# Altium schematic sheet CPU.SchDoc
size 420 x 297 mm
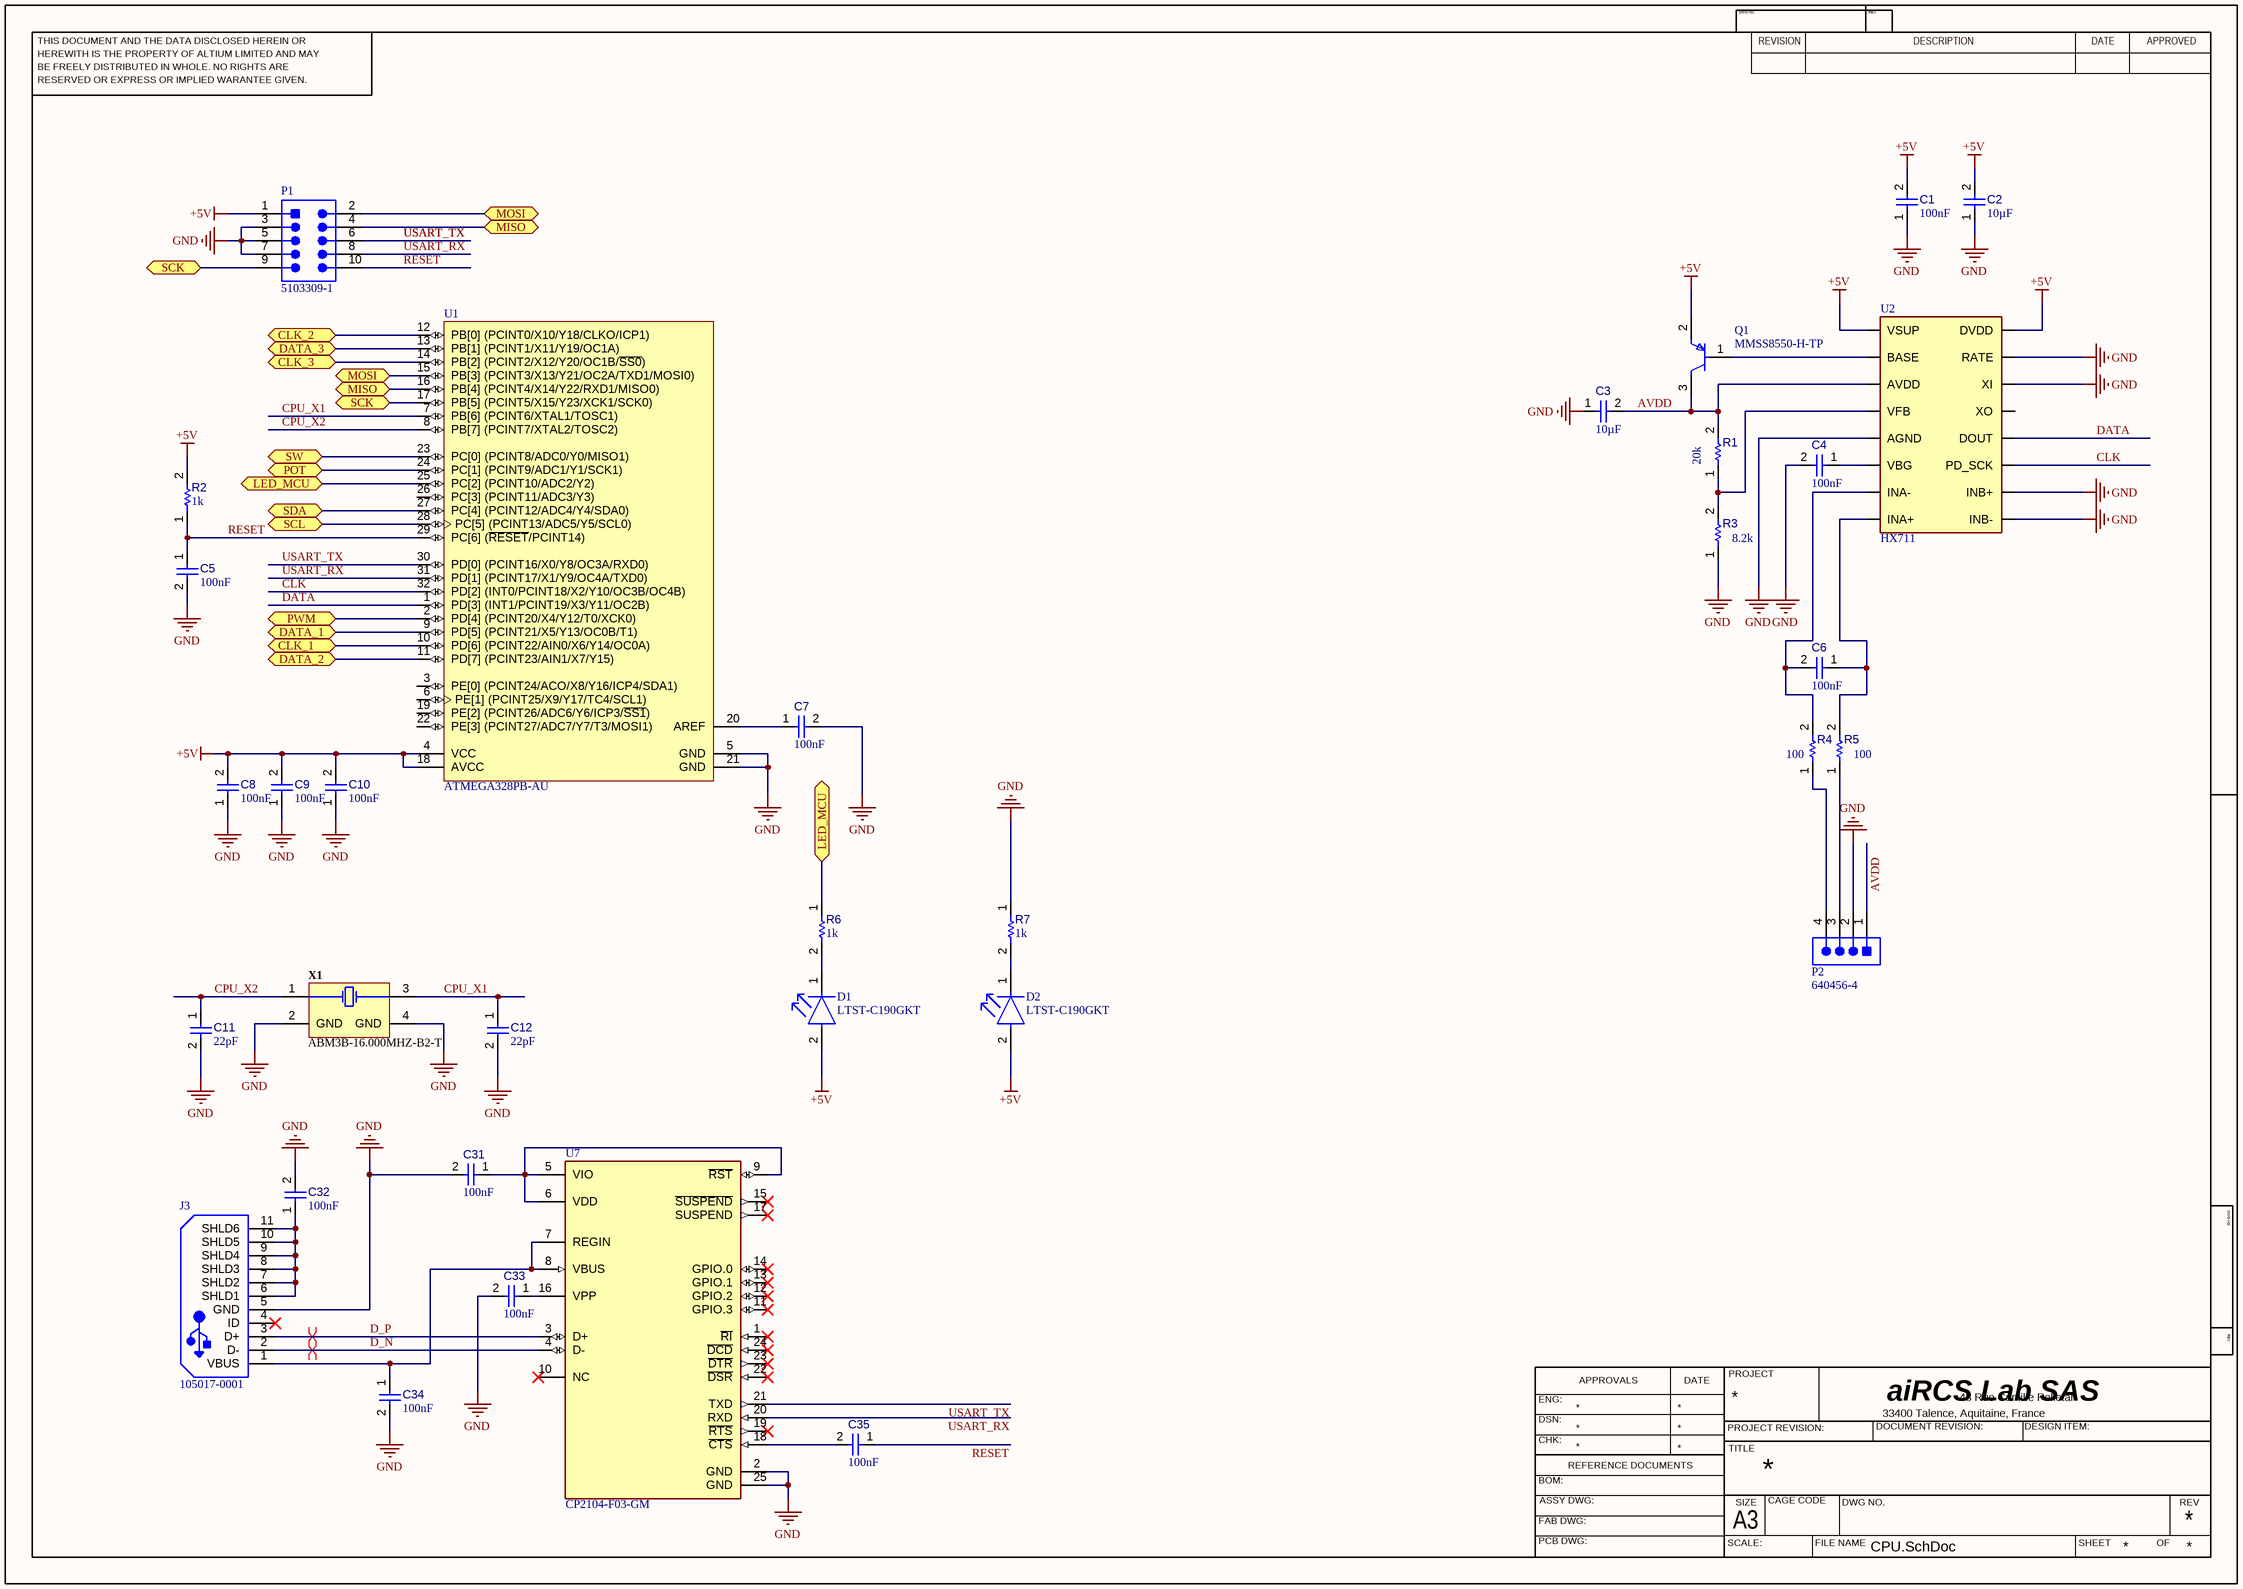
[diagram p0: CPU.SchDoc]

## Parts
C1  value 100nF  [CAPC0402(1005)60_L]  (hidden comment: Capacitor 100nF +/-20% 50V 0402)
C2  value 10µF  [CAPC0402(1005)60_L]  (hidden comment: Capacitor 10µF +/-40% 6.3V 0402)
C3  value 10µF  [CAPC0402(1005)60_L]  (hidden comment: Capacitor 10µF +/-40% 6.3V 0402)
C4  value 100nF  [CAPC0402(1005)60_L]  (hidden comment: Capacitor 100nF +/-20% 50V 0402)
C5  value 100nF  [CAPC0402(1005)60_L]  (hidden comment: Capacitor 100nF +/-20% 50V 0402)
C6  value 100nF  [CAPC0402(1005)60_L]  (hidden comment: Capacitor 100nF +/-20% 50V 0402)
C7  value 100nF  [CAPC0402(1005)60_L]  (hidden comment: Capacitor 100nF +/-20% 50V 0402)
C8  value 100nF  [CAPC0402(1005)60_L]  (hidden comment: Capacitor 100nF +/-20% 50V 0402)
C9  value 100nF  [CAPC0402(1005)60_L]  (hidden comment: Capacitor 100nF +/-20% 50V 0402)
C10  value 100nF  [CAPC0402(1005)60_L]  (hidden comment: Capacitor 100nF +/-20% 50V 0402)
C11  value 22pF  [CAPC0603(1608)100_L]  (hidden comment: Capacitor 1µF +/-40% 50V 0603)
C12  value 22pF  [CAPC0603(1608)100_L]  (hidden comment: Capacitor 1µF +/-40% 50V 0603)
C31  value 100nF  [CAPC0603(1608)100_L]  (hidden comment: Capacitor 1µF +/-40% 50V 0603)
C32  value 100nF  [CAPC0603(1608)100_L]  (hidden comment: Capacitor 1µF +/-40% 50V 0603)
C33  value 100nF  [CAPC0603(1608)100_L]  (hidden comment: Capacitor 1µF +/-40% 50V 0603)
C34  value 100nF  [CAPC0603(1608)100_L]  (hidden comment: Capacitor 1µF +/-40% 50V 0603)
C35  value 100nF  [CAPC0603(1608)100_L]  (hidden comment: Capacitor 1µF +/-40% 50V 0603)
D1  LTST-C190GKT  [FP-LTST-C190GKT-MFG]
D2  LTST-C190GKT  [FP-LTST-C190GKT-MFG]
J3  105017-0001  [USB-MICRO-B_V]
P1  5103309-1  [TECO-5103309-1_V]
P2  640456-4  [TECO-640456-4]
Q1  MMSS8550-H-TP  [FP-SOT-23-IPC_B]
R1  value 20k  [RESC0402(1005)_L]  (hidden comment: RES)
R2  1k  [RESC0402(1005)_L]
R3  value 8.2k  [RESC0402(1005)_L]
R4  100  [RESC0402(1005)_L]
R5  100  [RESC0402(1005)_L]
R6  1k  [RESC0402(1005)_L]
R7  1k  [RESC0402(1005)_L]
U1  ATMEGA328PB-AU  [ATML-32A_L]
U2  HX711  [SOP127P600X180-16N]
U7  CP2104-F03-GM  [FP-CP2104-F03-GM-MFG]
X1  ABM3B-16.000MHZ-B2-T  [ABRA-ABM3B-4_V]

## Ports
CLK_1 (bidir), CLK_2 (bidir), CLK_3 (bidir), DATA_1 (bidir), DATA_2 (bidir), DATA_3 (bidir), LED_MCU (bidir), MISO (bidir), MOSI (bidir), POT (bidir), PWM (bidir), SCK (bidir), SCL (bidir), SDA (bidir), SW (bidir)

## Nets
+5V: C1.2 C2.2 C8.2 C9.2 C10.2 D1.2(A) D2.2(A) P1.1 Q1.2(E) R2.2 U1.4(VCC) U1.18(AVCC) U2.1(VSUP) U2.16(DVDD)
GND: C1.1 C2.1 C3.1 C4.2 C5.2 C7.2 C8.1 C9.1 C10.1 C11.2 C12.2 C31.2 C32.2 C33.2 C34.2 J3.5(GND) P1.3 P1.5 P1.7 P2.2 R3.1 R7.1 U1.5(GND) U1.21(GND) U2.5(AGND) U2.9(INB-) U2.10(INB+) U2.14(XI) U2.15(RATE) U7.2(GND) U7.25(GND) X1.2(GND) X1.4(GND)
AVDD: C3.2 P2.1 Q1.3(C) R1.2 U2.3(AVDD)
CLK: U1.32(PD[2]_(INT0/PCINT18/X2/Y10/OC3B/OC4B)) U2.11(PD_SCK)
CLK_1: U1.10(PD[6]_(PCINT22/AIN0/X6/Y14/OC0A)) ; port CLK_1
CLK_2: U1.12(PB[0]_(PCINT0/X10/Y18/CLKO/ICP1)) ; port CLK_2
CLK_3: U1.14(PB[2]_(PCINT2/X12/Y20/OC1B/~{SS0})) ; port CLK_3
CPU_X1: C12.1 U1.7(PB[6]_(PCINT6/XTAL1/TOSC1)) X1.3(X2)
CPU_X2: C11.1 U1.8(PB[7]_(PCINT7/XTAL2/TOSC2)) X1.1(X1)
D_N: J3.2(D-) U7.4(D-)
D_P: J3.3(D+) U7.3(D+)
DATA: U1.1(PD[3]_(INT1/PCINT19/X3/Y11/OC2B)) U2.12(DOUT)
DATA_1: U1.9(PD[5]_(PCINT21/X5/Y13/OC0B/T1)) ; port DATA_1
DATA_2: U1.11(PD[7]_(PCINT23/AIN1/X7/Y15)) ; port DATA_2
DATA_3: U1.13(PB[1]_(PCINT1/X11/Y19/OC1A)) ; port DATA_3
LED_MCU: R6.1 U1.25(PC[2]_(PCINT10/ADC2/Y2)) ; port LED_MCU
MISO: P1.4 U1.16(PB[4]_(PCINT4/X14/Y22/RXD1/MISO0)) ; port MISO
MOSI: P1.2 U1.15(PB[3]_(PCINT3/X13/Y21/OC2A/TXD1/MOSI0)) ; port MOSI
POT: U1.24(PC[1]_(PCINT9/ADC1/Y1/SCK1)) ; port POT
PWM: U1.2(PD[4]_(PCINT20/X4/Y12/T0/XCK0)) ; port PWM
RESET: C5.1 C35.1 P1.10 R2.1 U1.29(PC[6]_(~{RESET}/PCINT14))
SCK: P1.9 U1.17(PB[5]_(PCINT5/X15/Y23/XCK1/SCK0)) ; port SCK
SCL: U1.28(PC[5]_(PCINT13/ADC5/Y5/SCL0)) ; port SCL
SDA: U1.27(PC[4]_(PCINT12/ADC4/Y4/SDA0)) ; port SDA
SW: U1.23(PC[0]_(PCINT8/ADC0/Y0/MISO1)) ; port SW
USART_RX: P1.8 U1.31(PD[1]_(PCINT17/X1/Y9/OC4A/TXD0)) U7.20(RXD)
USART_TX: P1.6 U1.30(PD[0]_(PCINT16/X0/Y8/OC3A/RXD0)) U7.21(TXD)
NetC4_1: C4.1 U2.6(VBG)
NetC6_1: C6.1 R5.2 U2.8(INA+)
NetC6_2: C6.2 R4.2 U2.7(INA-)
NetC7_1: C7.1 U1.20(AREF)
NetC31_1: C31.1 U7.5(VIO) U7.6(VDD) U7.9(~{RST})
NetC32_1: C32.1 J3.6(SHLD1) J3.7(SHLD2) J3.8(SHLD3) J3.9(SHLD4) J3.10(SHLD5) J3.11(SHLD6)
NetC33_1: C33.1 U7.16(VPP)
NetC34_1: C34.1 J3.1(VBUS) U7.7(REGIN) U7.8(VBUS)
NetC35_2: C35.2 U7.18(~{CTS})
NetD1_1: D1.1(C) R6.2
NetD2_1: D2.1(C) R7.2
NetP2_3: P2.3 R5.1
NetP2_4: P2.4 R4.1
NetQ1_1: Q1.1(B) U2.2(BASE)
NetR1_1: R1.1 R3.2 U2.4(VFB)

Not connected (* = marked no-connect by the designer): J3 4(ID)*; U1 3(PE[0]_(PCINT24/ACO/X8/Y16/ICP4/SDA1)) 6(PE[1]_(PCINT25/X9/Y17/TC4/SCL1)) 19(PE[2]_(PCINT26/ADC6/Y6/ICP3/~{SS1})) 22(PE[3]_(PCINT27/ADC7/Y7/T3/MOSI1)) 26(PC[3]_(PCINT11/ADC3/Y3)); U2 13(XO); U7 1(~{RI})* 10(NC)* 11(GPIO.3)* 12(GPIO.2)* 13(GPIO.1)* 14(GPIO.0)* 15(~{SUSPEND})* 17(SUSPEND)* 19(~{RTS})* 22(~{DSR})* 23(~{DTR})* 24(~{DCD})*

## Layout directives
differential pair: D_N, D_P

## Notes on the sheet
- THIS DOCUMENT AND THE DATA DISCLOSED HEREIN OR
- HEREWITH IS THE PROPERTY OF ALTIUM LIMITED AND MAY
- DWG NO:
- REVISION
- REV:
- DESCRIPTION
- DATE
- APPROVED
- BE FREELY DISTRIBUTED IN WHOLE. NO RIGHTS ARE
- RESERVED OR EXPRESS OR IMPLIED WARANTEE GIVEN.
- ENG:
- APPROVALS
- PROJECT
- aiRCS Lab SAS
- 33400 Talence, Aquitaine, France
- 48 Rue Camille Pelletan
- DSN:
- CHK:
- REFERENCE DOCUMENTS
- PROJECT REVISION:
- TITLE
- DOCUMENT REVISION:
- DESIGN ITEM:
- BOM:
- FAB DWG:
- PCB DWG:
- ASSY DWG:
- SCALE:
- A3
- SIZE
- CAGE CODE
- FILE NAME
- DWG NO.
- SHEET
- OF
- REV

## Library data of the parts
C1 C4-C10 = CMP-001-00067-3: Chip Capacitor, 100nF +/-20%, 50V, 0402, Thickness 0.6 mm; Tolerance: 10%; Min Operating Temperature: -55°C; Pins: 2; Case/Package: 0402; Max Operating Temperature: 85°C; Voltage Rating: 50V; Mounting Technology: SMT
C2 C3 = CMP-001-00074-3: Chip Capacitor, 10µF +/-40%, 6.3V, 0402, Thickness 0.6 mm; Tolerance: 10%; Case/Package: 0402; Pins: 2; Mounting Technology: SMT; Voltage Rating: 6.3V; Max Operating Temperature: 85°C; Min Operating Temperature: -55°C
C11 C12 C31-C35 = CMP-001-00078-4: Chip Capacitor, 1µF +/-40%, 50V, 0603, Thickness 1 mm; Tolerance: 10%; Case/Package: 0603; Pins: 2; Max Operating Temperature: 85°C; Voltage Rating: 50V; Mounting Technology: SMT; Min Operating Temperature: -55°C
D1 D2 = CMP-22017-000005-2: LED GREEN CLEAR CHIP SMD; Dominant Wavelength: 569nm; Reverse Voltage: 5V; Lens Color: Colorless; Viewing Angle: 130°; Voltage: 2V; Forward Current: 30mA; Power Dissipation: 100mW; Luminous Intensity: 6mcd; Number of LEDs: 1; Forward Voltage: 2.1V; Wavelength: 565nm; Test Current: 10mA; Min Operating Temperature: -55°C; Lens Style: Clear; Mount: Surface Mount; Width: 0.8mm; Packaging: Tape and Reel; Lens Transparency: Clear; Case Code (Metric): 1608; Depth: 0.8mm; Case Code (Imperial): 0603; Case/Package: 0603; Number of Pins: 2; Max Operating Temperature: 85°C; Lead Free: Lead Free; Number of Elements: 1; Length: 1.6mm; Height: 0.8mm; Package Quantity: 1; Power Rating: 100mW; Radiation Hardening: No; Illumination Color: Green; Color: Green
J3 = CMP-2000-05827-1: Micro-USB B Receptacle, Right Angle, Bottom Mount, Surface Mount, with Solder Tabs, -30 to 85 degC, 5-Pin USB, RoHS, Tape and Reel; Manufacturer: Molex; Featured Product: Micro-USBConnectorsUSBConnectors; Other Names: WM1399DKR; Package Version: Rev. F, 12/2012; Number of Contacts: 5; Connector Type: USB-microB; Catalog Drawings: 1050170001; 3D Model: 105017-0001.stp; Mating Products: WM17145-ND-CABLEMICROUSBBTOSTDA1.0MWM17147-ND-CABLEMICROUSBBTOSTDA2.0MWM17146-ND-CABLEMICROUSBBTOSTDA1.5M; PCN Assembly/Origin: ResinSupplier21/Oct/2015; Voltage - Max: 30V; Online Catalog: Molex-MicroUSB; Manufacturer URL: http://www.molex.com/; Package Description: 5-Leads USB, Micro B, Body 7.5 x 5 mm, Pitch 0.65 mm; Datasheet URL: http://www.molex.com/elqNow/elqRedir.htm?ref=http://www.molex.com/webdocs/datasheets/pdf/en-us/1050170001_IO_CONNECTORS.pdf; Ingress Protection: -; Datasheet Version: 03/2016; Mounting Type: BoardCutout,SurfaceMount,RightAngle; Circuits: 5; Standard Package: 1; Package Reference: MICRO-B; Package URL: http://www.molex.com/pdm_docs/sd/1050170001_sd.pdf; Category: Connectors,Interconnects; Series: -; RoHS Information: 1050170001CertofCompliance; Features: Shielded,SolderRetention; Family: USB,DVI,HDMIConnectors; Specifications: -; Gender: Receptacle; Packaging: Digi-Reel®; Mounting Technology: SurfaceMount
P1 = CMP-2000-07502-1: Male Header, Pitch 2.54 mm, 2 x 5 Position, Height 9.855 mm, Tail Length 3.048 mm, -65 to 105 degC, RoHS, Tube; Manufacturer: TE Connectivity; PCB Mounting Orientation: Vertical; Pitch: 2.54mm; Mating Connector Lock: No(Without); Body Material: Thermoplastic; Shrouded: Yes(With); Connector System: Wire-to-Board; Insulation Resistance: 5GR; Number of Positions: 10; Max Current Rating: 1A; PCB Mount Retention: Without; Manufacturer URL: http://www.te.com/; Contact Plating: Gold; Datasheet URL: http://www.te.com/commerce/DocumentDelivery/DDEController?Action=showdoc&DocId=Customer+Drawing%7F5103309%7FE1%7Fpdf%7FEnglish%7FENG_CD_5103309_E1.pdf%7F5103309-1; Colour: Black; Termination: ThroughHole; Housing Colour: Black; Flammability Rating: UL94V-0; Package Description: Male Header, Pitch 2.54 mm, 2 x 5 Position, Height 9.855 mm, Tail Length 3.048 mm; Mating Retention: No(Without); Orientation: Straight; Row Spacing: 2.54mm; Termination Post Length: 0.12inch; Min Operating Temperature: -65degC; Board Standoff: Yes(With); REACH SVHC: NoSVHC; Depth: 9.14mm; Lead Free: LeadFree; Gender: Male; Connector Type: Header; Shrouded End Dimension: 3.81mm; ELV: Compliant; Mating Alignment: Yes(With); Panel Mount Retention: No(Without); Package Quantity: 35; PCB Mount Alignment: No(Without); Number of Rows: 2; Package Reference: 5103309-1; Mounting Technology: ThroughHole; Mount: ThroughHole; Contact Gender: Male; Number of Contacts: 10; Length: 0.8inch; Current Rating: 1A; Contact Mating Length: 0.24inch; Max Operating Temperature: 105degC; RoHSCompliant: True; Datasheet Version: Rev. E1, 03/2011; Contact Shape: Square; Height: 8.813mm; Housing Material: PBT; Contact Material: CopperAlloy; Packaging: Rail/Tube
P2 = CMP-2000-05419-1: Male Header, Pitch 2.54 mm, 1 x 4 Position, Height 10.03 mm, Tail Length 3.56 mm, RoHS, Bulk; Manufacturer: TE Connectivity; Material, Housing: Polyester; Primary Type: InterconnectSystem; Mount Angle: Vertical; Color, Housing: White; Current, Rating: 5 / A; Agency Approvals: CSA,UL; Contact Termination Area Plating: Tin; Temperature, Operating: -55to+105 / degC; Standards: RoHSCompliant,ELVCompliant,UL94V-0; Number of Positions: 4; Brand/Series: MTA-100Series; Angle: Straight; Pin Spacing: 0.1 / "; Material, Contact: CopperAlloy; Connector Type: MTA-100; Special Features: Pinstrip; Mounting Hole Size: 0.04 / "; Contact Centerline Spacing: 0.100 / in.; Voltage, Rating: 250 / V; Manufacturer URL: http://www.te.com/; Length, Pin: 0.14 / "; Length, Overall: 0.4 / "; Color: White; Flammability Rating: UL94V-0; Mounting Type: PCMount; Termination: Solder; Datasheet URL: https://datasheet.ciiva.com/16286/eng-ds-82056-mta-0608-16286228.pdf; Number of Contacts: 4; Contact Shape: Square; Contact Mating Area Plating: Tin; Length, Terminal Post: 0.14 / in.; Size, Post: 0.025 / in.; Contact Plating: Tin; Type: PCBPlug; Datasheet Version: Dec-14; Number of Rows: 1
Q1 = CMP-56214-000002-1: TRANS PNP 25V 1.5A SOT23; Emitter Base Voltage (VEBO): 1.6V; Collector Base Voltage (VCBO): 40V; Collector Emitter Saturation Voltage: 500mV; Max Power Dissipation: 625mW; Transition Frequency: 100MHz; Element Configuration: Single; hFE Min: 40; Polarity: PNP; Lead Free: Lead Free; Max Breakdown Voltage: 25V; Package Quantity: 1; Min Operating Temperature: -55°C; Case/Package: SOT-23; Max Collector Current: 1.5A; Mount: Surface Mount; Packaging: Tape and Reel; Collector Emitter Voltage (VCEO): 500mV; Max Operating Temperature: 150°C; Gain Bandwidth Product: 100MHz; Collector Emitter Breakdown Voltage: 25V
R1 R3 = CMP-009-00062-5: Resistor 0402; Mounting Technology: SMT; Pins: 2; Case/Package: 0402
R2 R4-R7 = CMP-009-00062-5: Mounting Technology: SMT; Pins: 2; Case/Package: 0402
  R2 R6 R7: Value: 1k
  R4 R5: Value: 100
U1 = CMP-2000-07439-1: AVR Microcontroller, 1.8 to 5.5 V, 32 KB Flash, 1 KB EEPROM, 2 KB SRAM, -40 to 85 degC, 32-Pin TQFP (32A), RoHS, Tray; Manufacturer: Microchip; Datasheet URL: http://ww1.microchip.com/downloads/en/DeviceDoc/40001906A.pdf; Mounting Technology: SurfaceMount; RoHSCompliant: false; Manufacturer URL: http://www.microchip.com/; Package Description: 32-Pin Thin Profile Plastic Quad Flat Package, Body 7 x 7 mm, Pitch 0.8 mm; Package Reference: 32A; Datasheet Version: Rev. A, 04/2017
U2 = HX711: <h3>AVIA Semiconductor HX711 - ADC</h3> <p>24-Bit Analog-to-Digital Converter for Weigh Scales <li><a href=â€https://cdn.sparkfun.com/datasheets/Sensors/ForceFlex/hx711_english.pdfâ€>Datasheet</a></li> </p> <p><b>SparkFun Products:</b> <ul><li><a href=â€https://www.sparkfun.com/products/13879â€>SparkFun Load Cell Amplifier - HX711 </a></li> </ul></p>; MF: AVIA SEMICONDUCTOR; Price: None; Availability: Unavailable; Value: *; SnapEDA_Link: https://www.snapeda.com/parts/HX711/AVIA%20SEMICONDUCTOR/view-part/4804859/?ref=snap; Package: None; MP: HX711; Check_prices: https://www.snapeda.com/parts/HX711/AVIA%20SEMICONDUCTOR/view-part/4804859/?ref=eda
U7 = CMP-0511-00004-2: IC SGL USB-TO-UART BRIDGE 24QFN; Number of Transceivers: 1; Max Supply Voltage: 3.6V; Operating Supply Current: 17mA; Operating Supply Voltage: 3.3V; Data Rate: 2Mbps; Min Supply Voltage: 3V; Number of Channels: 1; Max Operating Temperature: 85°C; Contact Plating: Tin; Min Operating Temperature: -40°C; Number of Pins: 24; Case/Package: QFN; Packaging: Rail/Tube; Radiation Hardening: No; Weight: 0.001764oz
X1 = CMP-1688-00003-1: Ceramic SMD Crystal, 16 MHz, +/- 20 ppm, 50 Ohm, -20 to 70 degC, 4-Pin SMD, RoHS, Tape and Reel; Current Rating: 1.82 A; Resistance: 0.033 Ohm; Tolerance: 30%; Shielding: Shielded; REACH SVHC: Unknown; RoHSCompliant: True; PackageReference: ABM3B; Mount: Surface Mount; Max Operating Temperature: 105degC; DatasheetVersion: Aug-15; Package Quantity: 500; PackageDescription: 4-Pin Surface Mount Device, Body 5 x 3.2 mm; ComponentLink2URL: http://www.abracon.com/Resonators/abm3b.pdf; Packaging: Tape and Reel; Height: 2.8 mm; ComponentLink1URL: http://www.abracon.com/; ComponentLink2Description: Datasheet; Length: 0.197 inch; ComponentLink1Description: Manufacturer URL; Case/Package: 5028; Width: 0.197 inch; Min Operating Temperature: -40degC